# EAGLE design Tachometr (EAGLE 6.4)
Czujnik predkosci obrotowej
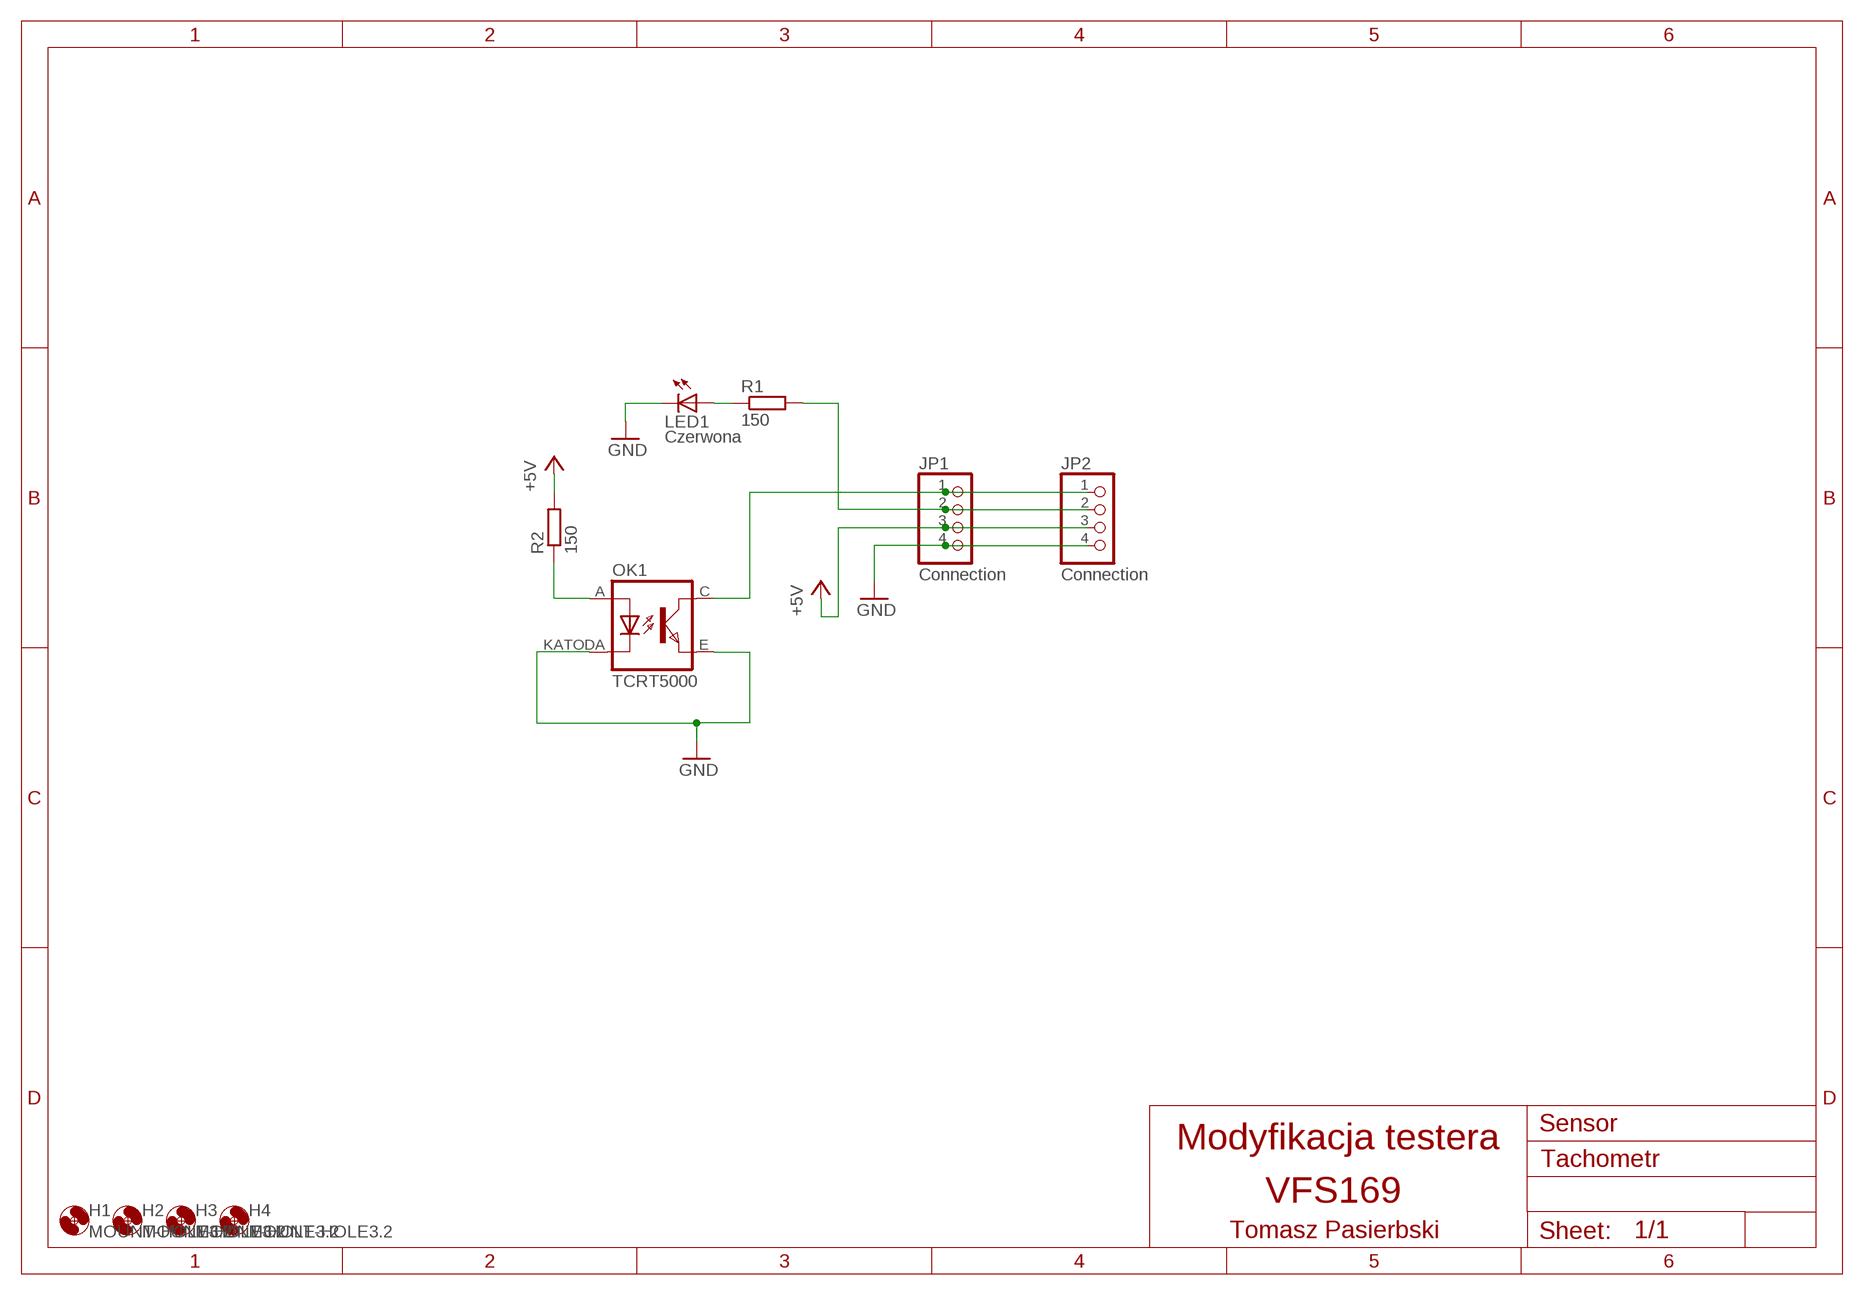
[diagram p0: schematic, sheet 1]

## Parts
H1  MOUNT-HOLE3.2  [3,2]
H2  MOUNT-HOLE3.2  [3,2]
H3  MOUNT-HOLE3.2  [3,2]
H4  MOUNT-HOLE3.2  [3,2]
JP1  Connection  PINHD-1X4/90  [1X04/90]
JP2  Connection  PINHD-1X4  [1X04]
LED1  Czerwona  LEDCHIPLED_1206  [CHIPLED_1206]
OK1  TCRT5000  [TCRT5000]
R1  150  R-EU_R1206  [R1206]
R2  150  R-EU_R1206  [R1206]

## Nets
+5V: JP1.3 JP2.3 R2.2
GND: JP1.4 JP2.4 LED1.C OK1.E(EMITTER) OK1.KATODA(CATHODE)
N$3: OK1.A(ANODE) R2.1
N$4: LED1.A R1.1
N$5: JP1.2 JP2.2 R1.2
N$6: JP1.1 JP2.1 OK1.C(COLLECTOR)

## Notes on the sheet
- Sensor
- Modyfikacja testera
- VFS169
- Tomasz Pasierbski

## Library data of the parts
H1-H4 = holes:MOUNT-HOLE: MOUNTING HOLE with drill center marker
JP1 JP2 = pinhead:PINHD-1X4: PIN HEADER
LED1 = led:LED: LED OSRAM: - CHIPLED LG R971, LG N971, LY N971, LG Q971, LY Q971, LO R971, LY R971 LH N974, LH R974 LS Q976, LO Q976, LY Q976 LO Q996 - Hyper CHIPLED LW Q18S LB Q993, LB Q99A, LB R99A - SideLED LS A670, LO A670, LY A670, LG A670, LP A670 LB A673, LV A673, LT A673, LW A673 LH A674 LY A675 LS A676, LA A676, LO A676, LY A676, LW A676 LS A679, LY A679, LG A679 - Hyper Micro SIDELED® LS Y876, LA Y876, LO Y876, LY Y876 LT Y87S - SmartLED LW L88C, LW L88S LB L89C, LB L89S, LG L890 LS L89K, LO L89K, LY L89K LS L896, LA L896, LO L896, LY L896 - TOPLED LS T670, LO T670, LY T670, LG T670, LP T670 LSG T670, LSP T670, LSY T670, LOP T670, LYG T670 LG T671, LOG T671, LSG T671 LB T673, LV T673, LT T673, LW T673 LH T674 LS T676, LA T676, LO T676, LY T676, LB T676, LH T676, LSB T676, LW T676 LB T67C, LV T67C, LT T67C, LS T67K, LO T67K, LY T67K, LW E67C LS E67B, LA E67B, LO E67B, LY E67B, LB E67C, LV E67C, LT E67C LW T67C LS T679, LY T679, LG T679 LS T770, LO T770, LY T770, LG T770, LP T770 LB T773, LV T773, LT T773, LW T773 LH T774 LS E675, LA E675, LY E675, LS T675 LS T776, LA T776, LO T776, LY T776, LB T776 LHGB T686 LT T68C, LB T68C - Hyper Mini TOPLED® LB M676 - Mini TOPLED Santana® LG M470 LS M47K, LO M47K, LY M47K Source: http://www.osram.convergy.de LUXEON: - LUMILED® LXK2-PW12-R00, LXK2-PW12-S00, LXK2-PW14-U00, LXK2-PW14-V00 LXK2-PM12-R00, LXK2-PM12-S00, LXK2-PM14-U00 LXK2-PE12-Q00, LXK2-PE12-R00, LXK2-PE12-S00, LXK2-PE14-T00, LXK2-PE14-U00 LXK2-PB12-K00, LXK2-PB12-L00, LXK2-PB12-M00, LXK2-PB14-N00, LXK2-PB14-P00, LXK2-PB14-Q00 LXK2-PR12-L00, LXK2-PR12-M00, LXK2-PR14-Q00, LXK2-PR14-R00 LXK2-PD12-Q00, LXK2-PD12-R00, LXK2-PD12-S00 LXK2-PH12-R00, LXK2-PH12-S00 LXK2-PL12-P00, LXK2-PL12-Q00, LXK2-PL12-R00 Source: www.luxeon.com KINGBRIGHT: KA-3528ASYC Source: www.kingbright.com
OK1 = vishay:TCRT5000
R1 R2 = rcl:R-EU_: RESISTOR, European symbol

## Board
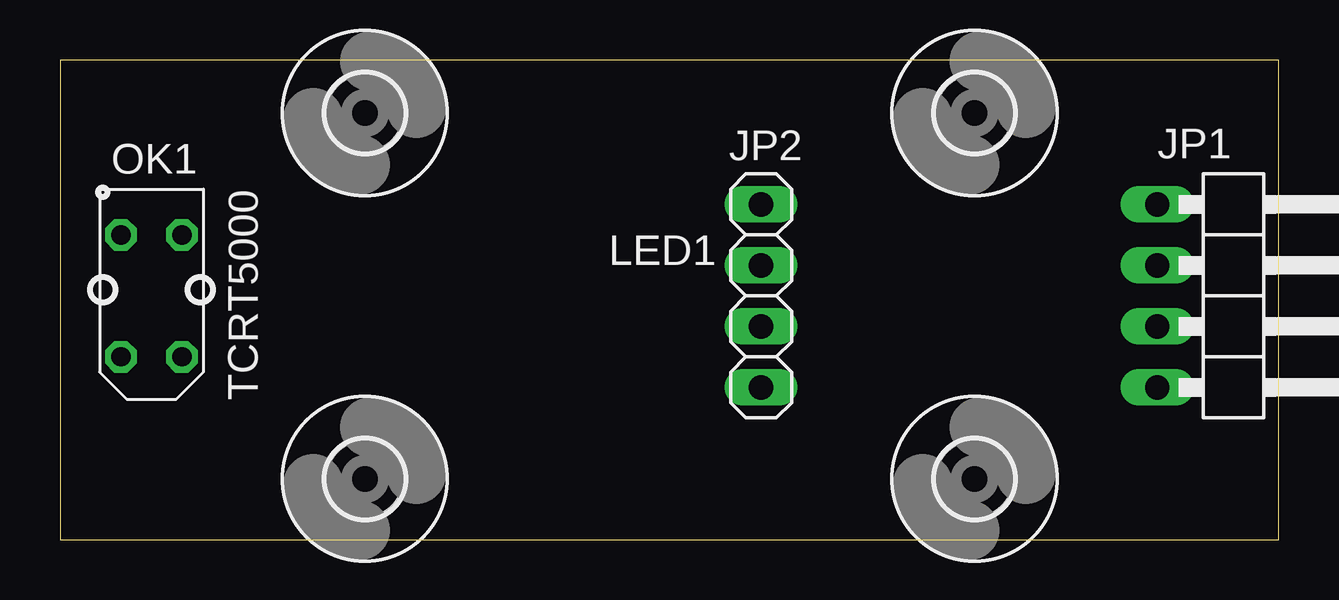
[diagram p1: board, top side]
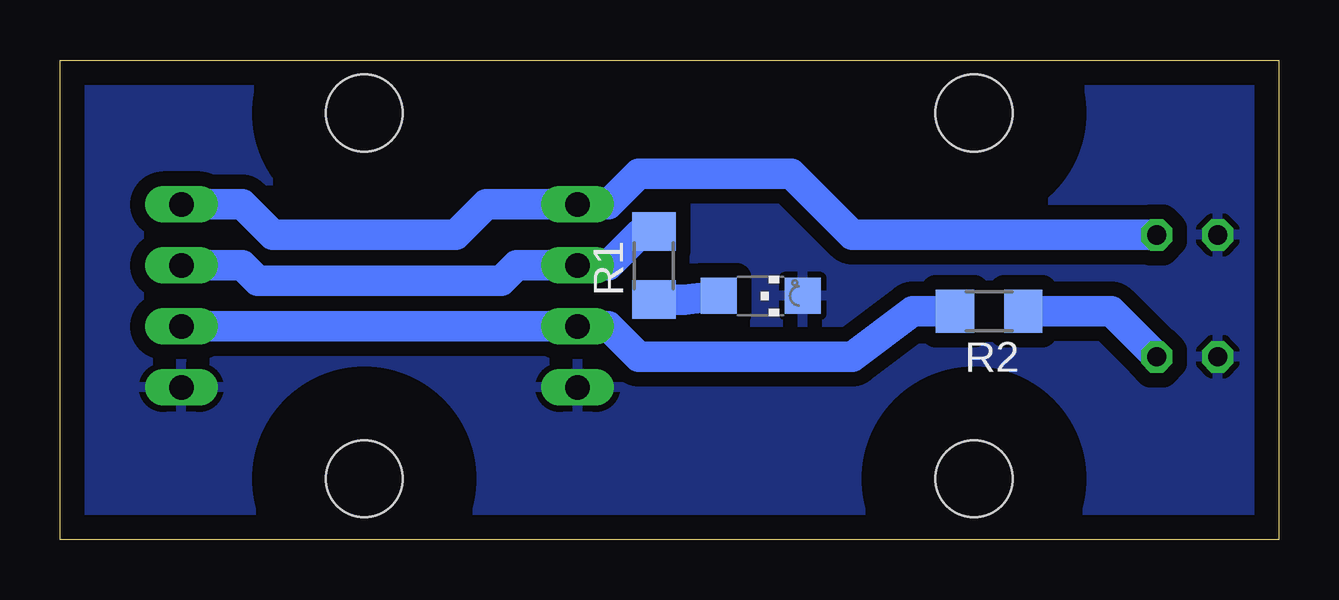
[diagram p2: board, bottom side, seen from below]

Size 50.78 x 19.99 mm. Coordinates in mm from the lower left corner, seen from the top.
Outline: 0,0 50.78,0 50.78,19.99 0,19.99 0,0
Copper layers (1*16): Top 0.035mm / dielectric 1.5mm / Bottom 0.035mm
Design rules "default": minimum track width 10mil, minimum drill 24mil, track to track 8mil, track to pad 8mil, pad to pad 8mil, via to via 8mil, smd to smd 8mil, copper to edge 40mil, drill to drill 8mil, minimum pad ring 10mil, minimum via ring 8mil, stop-mask expansion 4mil, vias tented up to drill 0mil, thermal gap 10mil

### Footprints (pad centres in the part's own frame; a part is rotated, then mirrored left to right if it is on the bottom)
3,2 = hole 3.2: 0,0
1X04/90 = drill 1.016 long: 1 -3.81,-3.81; 2 -1.27,-3.81; 3 1.27,-3.81; 4 3.81,-3.81
1X04 = drill 1.016 long: 1 -3.81,0; 2 -1.27,0; 3 1.27,0; 4 3.81,0
CHIPLED_1206 = smd 1.5 x 1.5: A 0,-1.75; C 0,1.75
TCRT5000 = drill 0.8 octagon: A -2.54,-1.27; C 2.54,-1.27; E 2.54,1.27; KATODA -2.54,1.27
R1206 = smd 1.6 x 1.803: 1 -1.422,0; 2 1.422,0

### Placement (x,y rotation side)
DRILEGEND  [DRILEGEND]  -18.19,-20.57 0 top  (outside the outline)
H1  38.1,17.78 0 top
H2  38.1,2.54 0 top
H3  12.7,17.78 0 top
H4  12.7,2.54 0 top
JP1  49.53,10.16 270 top
JP2  29.21,10.16 270 top
LED1  21.59,10.16 270 bottom
OK1  3.81,10.16 90 top
R1  26.04,11.43 90 bottom
R2  12.06,9.53 180 bottom
U$1  [A5L-LOC]  -69.85,-78.74 0 top  (outside the outline)

### Tracks (layer width: path | path; a pad name or v marks a point on that pad's centre or on a via)
+5V
  Bottom 0.813: JP2.3 27.94,8.89
  Bottom 1.27: JP1.3 JP2.3 | 27.94,8.89 26.67,7.62 17.78,7.62 15.24,9.53 R2.2
GND
  pour Bottom (isolate 0.61): 0,20.32 50.8,20.32 50.8,0 0,0
N$3
  Bottom 1.27: OK1.A 6.99,9.53 R2.1
N$4
  Bottom 1.27: R1.1 24.76,10.01 LED1.A
N$5
  Bottom 0.813: 26.67,12.7 26.19,12.7 R1.2
  Bottom 1.27: JP1.2 43.18,11.43 42.55,10.79 32.38,10.79 31.75,11.43 JP2.2 27.94,11.43 26.67,12.7
N$6
  Bottom 1.27: JP1.1 43.18,13.97 41.91,12.7 34.29,12.7 33.02,13.97 JP2.1 27.94,13.97 26.67,15.24 20.32,15.24 17.78,12.7 OK1.C

### Text on the board
Document: Sensor | Dioda | +5V | GND | PCB | Modyfikacja testera | VFS169 | Tomasz Pasierbski